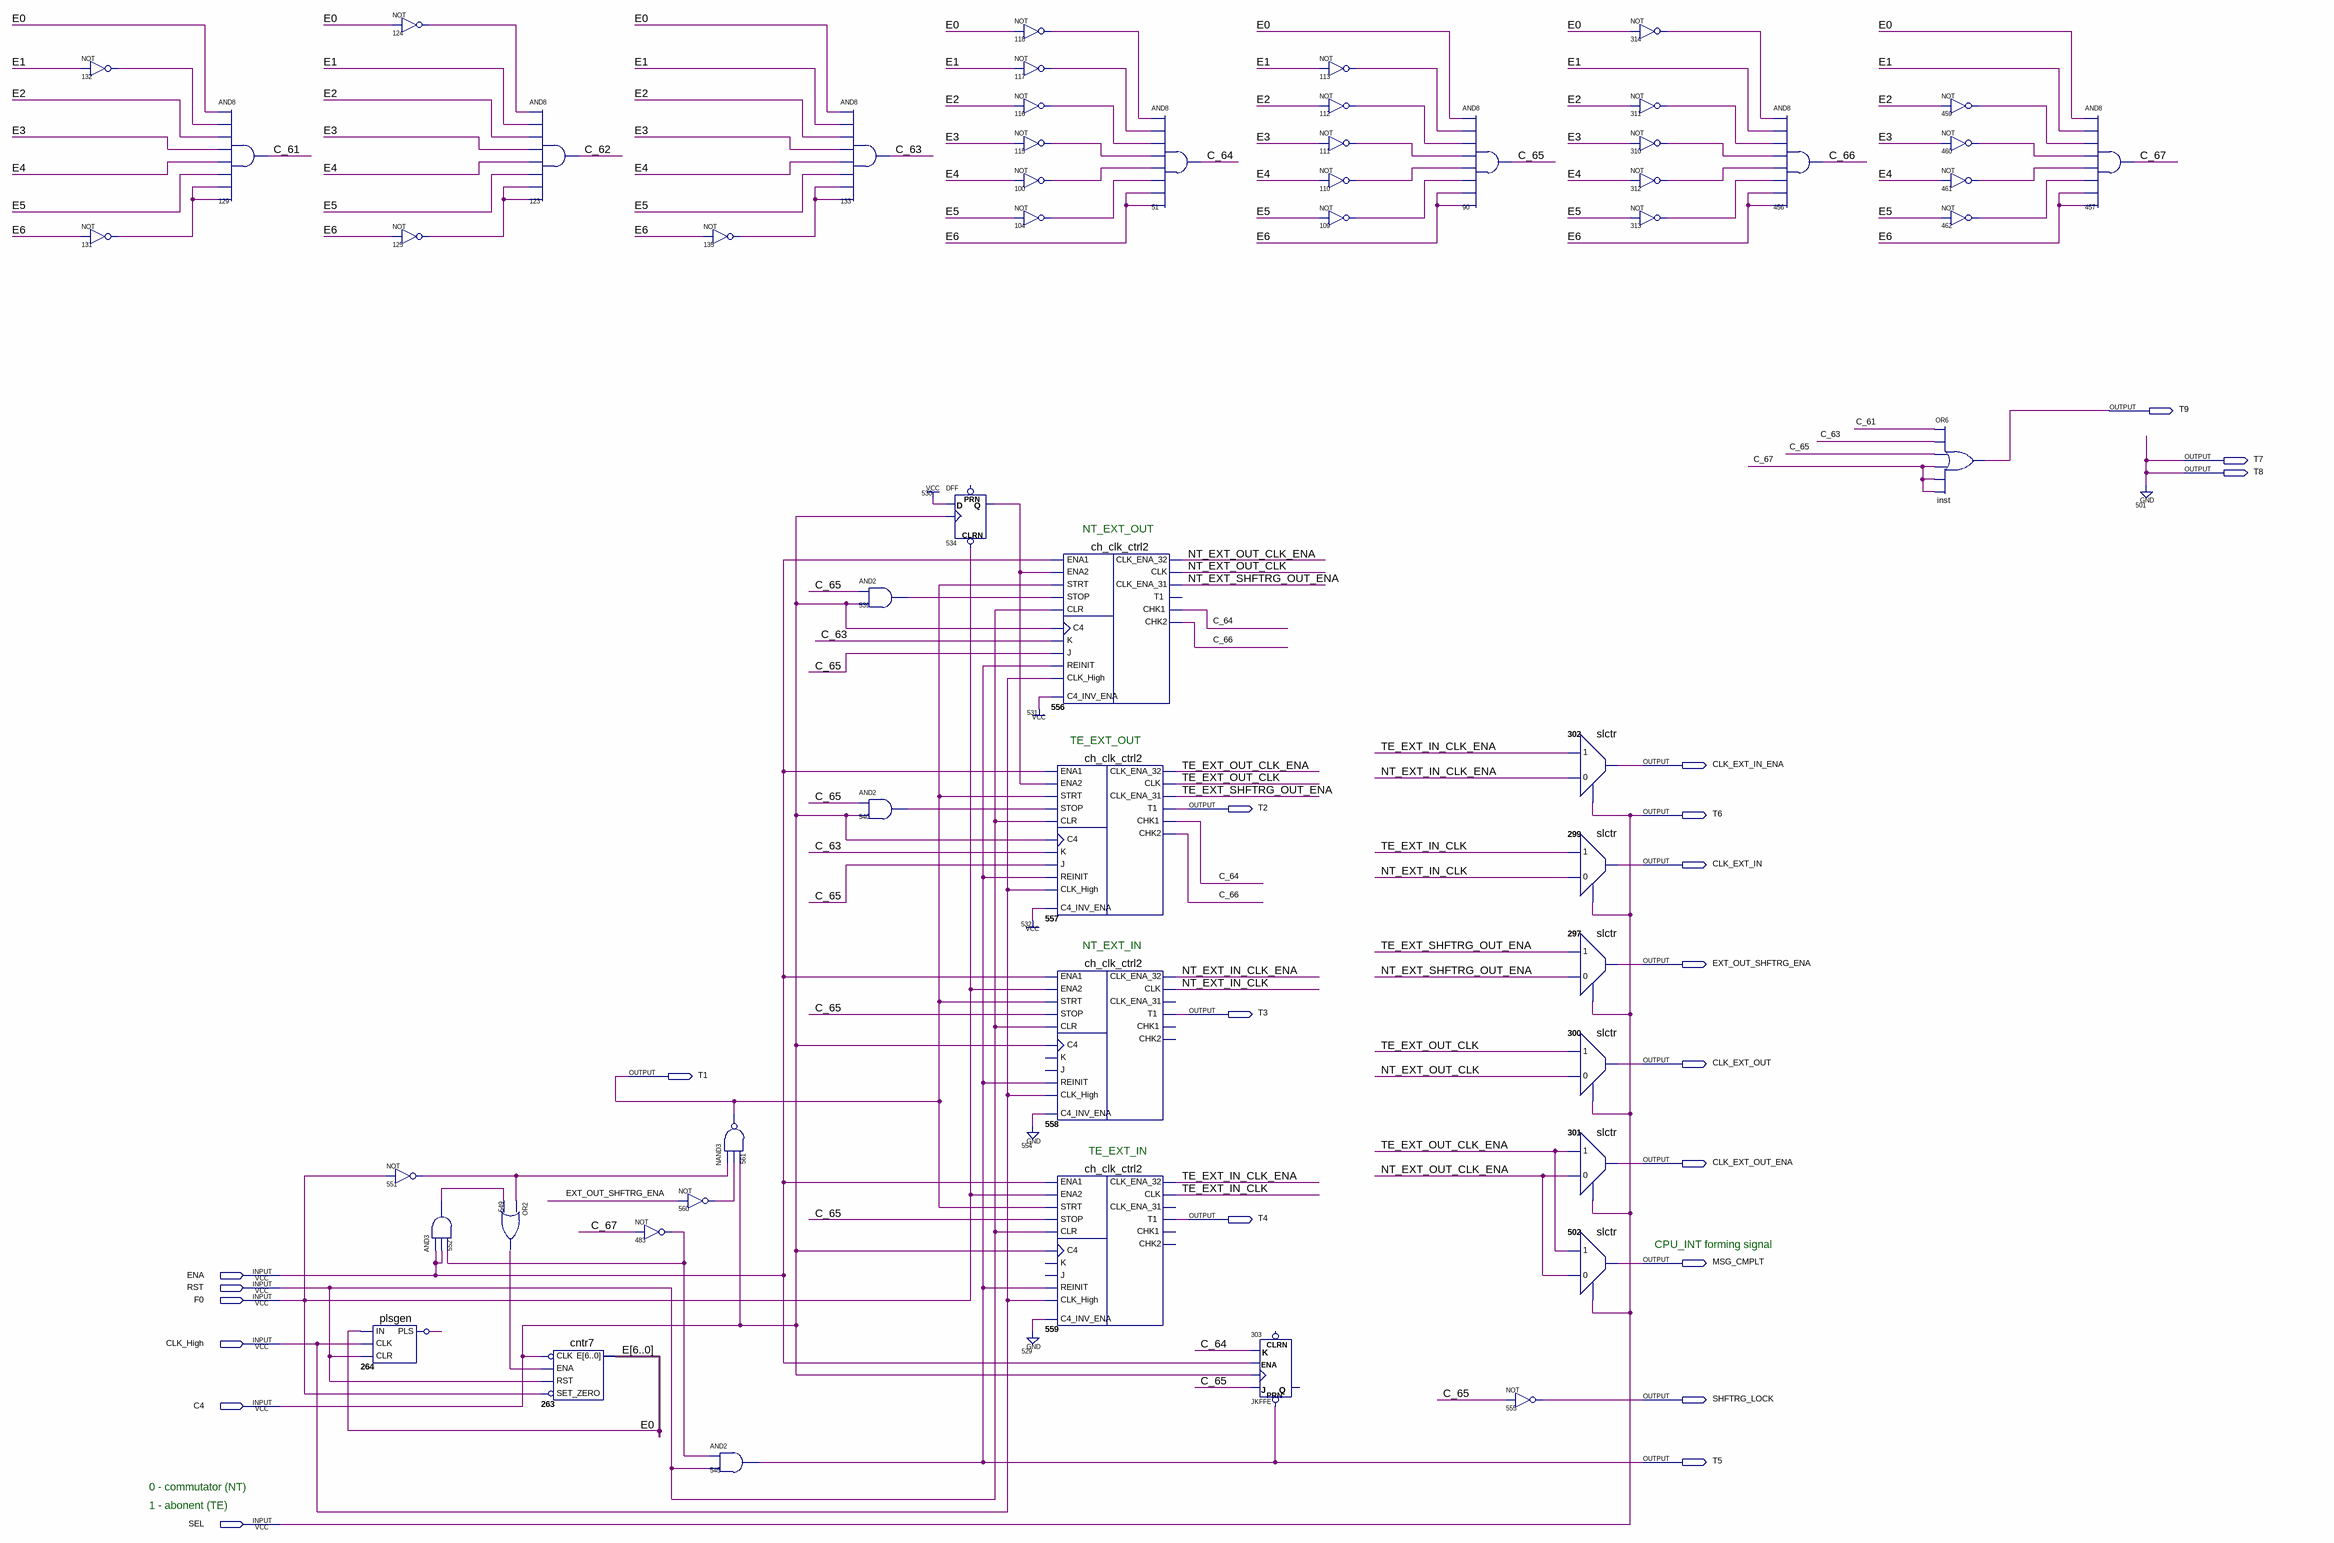
[diagram p0: schematic sheet]
// Quartus schematic shrg_ctrl5.bdf as structural Verilog: 57 symbols, 22 pins
module shrg_ctrl5 (
  input  ENA,
  input  RST,
  input  F0,
  input  CLK_High,
  input  C4,
  input  SEL,
  output T9,
  output T7,
  output T8,
  output CLK_EXT_IN_ENA,
  output T2,
  output T6,
  output CLK_EXT_IN,
  output EXT_OUT_SHFTRG_ENA,
  output T3,
  output CLK_EXT_OUT,
  output T1,
  output CLK_EXT_OUT_ENA,
  output T4,
  output MSG_CMPLT,
  output SHFTRG_LOCK,
  output T5
);

  wire C_61, C_62, C_63, C_64, C_65, C_66, C_67, n100_out, n104_out, n109_out, n110_out, n111_out, n112_out,
       n113_out, n115_out, n116_out, n117_out, n118_out, n124_out, n125_out, n131_out, n132_out, n135_out,
       n264_pls, n264_PLS_inverted_out, n310_out, n311_out, n312_out, n313_out, n314_out, n459_out, n460_out,
       n461_out, n462_out, n483_out, n534_q, n539_out, n540_out, n549_out, n551_out, n552_out, n560_out,
       NT_EXT_IN_CLK, NT_EXT_IN_CLK_ENA, NT_EXT_OUT_CLK, NT_EXT_OUT_CLK_ENA, NT_EXT_SHFTRG_OUT_ENA,
       TE_EXT_IN_CLK, TE_EXT_IN_CLK_ENA, TE_EXT_OUT_CLK, TE_EXT_OUT_CLK_ENA, TE_EXT_SHFTRG_OUT_ENA;
  wire [6:0] E;

  not u_132 (n132_out, E[1]);
  not u_131 (n131_out, E[6]);
  and u_129 (C_61, E[0], n132_out, E[2], E[3], E[4], E[5], n131_out, n131_out);
  not u_124 (n124_out, E[0]);
  not u_125 (n125_out, E[6]);
  not u_551 (n551_out, F0);
  plsgen u_264 (.IN(E[0]), .CLK(CLK_High), .CLR(RST), .PLS(n264_pls));
  not u_264_PLS_inverted (n264_PLS_inverted_out, n264_pls);
  and u_552 (n552_out, ENA, ENA, n483_out);
  and u_123 (C_62, n124_out, E[1], E[2], E[3], E[4], E[5], n125_out, n125_out);
  or u_549 (n549_out, n551_out, n552_out);
  cntr7 u_263 (.CLK(~C4), .ENA(n549_out), .RST(RST), .SET_ZERO(~F0), .E(E));
  not u_483 (n483_out, C_67);
  not u_560 (n560_out, EXT_OUT_SHFTRG_ENA);
  not u_135 (n135_out, E[6]);
  nand u_561 (T1, n551_out, n560_out, C4);
  and u_545 (T5, n483_out, RST);
  and u_133 (C_63, E[0], E[1], E[2], E[3], E[4], E[5], n135_out, n135_out);
  and u_539 (n539_out, C_65, C4);
  and u_540 (n540_out, C_65, C4);
  DFF u_534 (.CLRN(F0), .CLK(C4), .D(1'b1), .Q(n534_q));  // open: PRN
  not u_118 (n118_out, E[0]);
  not u_117 (n117_out, E[1]);
  not u_116 (n116_out, E[2]);
  not u_115 (n115_out, E[3]);
  not u_100 (n100_out, E[4]);
  not u_104 (n104_out, E[5]);
  ch_clk_ctrl2 u_556 (
    .STRT(T1), .STOP(n539_out), .CLR(RST), .C4_INV_ENA(1'b1), .ENA1(ENA), .ENA2(n534_q), .C4(C4), .K(C_63),
    .J(C_65), .REINIT(T5), .CLK_High(CLK_High), .CHK2(C_66), .CHK1(C_64), .CLK_ENA_32(NT_EXT_OUT_CLK_ENA),
    .CLK(NT_EXT_OUT_CLK), .CLK_ENA_31(NT_EXT_SHFTRG_OUT_ENA));  // open: T1
  ch_clk_ctrl2 u_557 (
    .STRT(T1), .STOP(n540_out), .CLR(RST), .C4_INV_ENA(1'b1), .ENA1(ENA), .ENA2(n534_q), .C4(C4), .K(C_63),
    .J(C_65), .REINIT(T5), .CLK_High(CLK_High), .CHK2(C_66), .CHK1(C_64), .CLK_ENA_32(TE_EXT_OUT_CLK_ENA),
    .CLK(TE_EXT_OUT_CLK), .CLK_ENA_31(TE_EXT_SHFTRG_OUT_ENA), .T1(T2));
  ch_clk_ctrl2 u_558 (
    .STRT(T1), .STOP(C_65), .CLR(RST), .C4_INV_ENA(1'b0), .ENA1(ENA), .ENA2(F0), .C4(C4), .REINIT(T5),
    .CLK_High(CLK_High), .CLK_ENA_32(NT_EXT_IN_CLK_ENA), .CLK(NT_EXT_IN_CLK), .T1(T3));  // open: K, J, CHK2, CHK1, CLK_ENA_31
  ch_clk_ctrl2 u_559 (
    .STRT(T1), .STOP(C_65), .CLR(RST), .C4_INV_ENA(1'b0), .ENA1(ENA), .ENA2(F0), .C4(C4), .REINIT(T5),
    .CLK_High(CLK_High), .CLK_ENA_32(TE_EXT_IN_CLK_ENA), .CLK(TE_EXT_IN_CLK), .T1(T4));  // open: K, J, CHK2, CHK1, CLK_ENA_31
  and u_51 (C_64, n118_out, n117_out, n116_out, n115_out, n100_out, n104_out, E[6], E[6]);
  JKFFE u_303 (.PRN(T5), .J(C_65), .CLK(C4), .K(C_64), .ENA(ENA));  // open: CLRN, Q
  not u_113 (n113_out, E[1]);
  not u_112 (n112_out, E[2]);
  not u_111 (n111_out, E[3]);
  not u_110 (n110_out, E[4]);
  not u_109 (n109_out, E[5]);
  and u_90 (C_65, E[0], n113_out, n112_out, n111_out, n110_out, n109_out, E[6], E[6]);
  not u_555 (SHFTRG_LOCK, C_65);
  slctr u_302 (.SEL(SEL), .In0(NT_EXT_IN_CLK_ENA), .In1(TE_EXT_IN_CLK_ENA), .Out(CLK_EXT_IN_ENA));
  slctr u_299 (.SEL(SEL), .In0(NT_EXT_IN_CLK), .In1(TE_EXT_IN_CLK), .Out(CLK_EXT_IN));
  slctr u_297 (.SEL(SEL), .In0(NT_EXT_SHFTRG_OUT_ENA), .In1(TE_EXT_SHFTRG_OUT_ENA), .Out(EXT_OUT_SHFTRG_ENA));
  slctr u_300 (.SEL(SEL), .In0(NT_EXT_OUT_CLK), .In1(TE_EXT_OUT_CLK), .Out(CLK_EXT_OUT));
  slctr u_301 (.SEL(SEL), .In0(NT_EXT_OUT_CLK_ENA), .In1(TE_EXT_OUT_CLK_ENA), .Out(CLK_EXT_OUT_ENA));
  slctr u_502 (.SEL(SEL), .In0(NT_EXT_OUT_CLK_ENA), .In1(TE_EXT_OUT_CLK_ENA), .Out(MSG_CMPLT));
  not u_314 (n314_out, E[0]);
  not u_311 (n311_out, E[2]);
  not u_310 (n310_out, E[3]);
  not u_312 (n312_out, E[4]);
  not u_313 (n313_out, E[5]);
  and u_456 (C_66, n314_out, E[1], n311_out, n310_out, n312_out, n313_out, E[6], E[6]);
  or inst (T9, C_61, C_63, C_65, C_67, C_67, C_67);
  not u_459 (n459_out, E[2]);
  not u_460 (n460_out, E[3]);
  not u_461 (n461_out, E[4]);
  not u_462 (n462_out, E[5]);
  and u_457 (C_67, E[0], E[1], n459_out, n460_out, n461_out, n462_out, E[6], E[6]);

  assign T6 = SEL;
  assign T7 = 1'b0;
  assign T8 = 1'b0;

  // Notes on the sheet:
  //   NT_EXT_OUT
  //   TE_EXT_OUT
  //   NT_EXT_IN
  //   TE_EXT_IN
  //   CPU_INT forming signal
  //   0 - commutator (NT)
  //   1 - abonent (TE)
endmodule
